# Altium project Sensor.PrjPcb
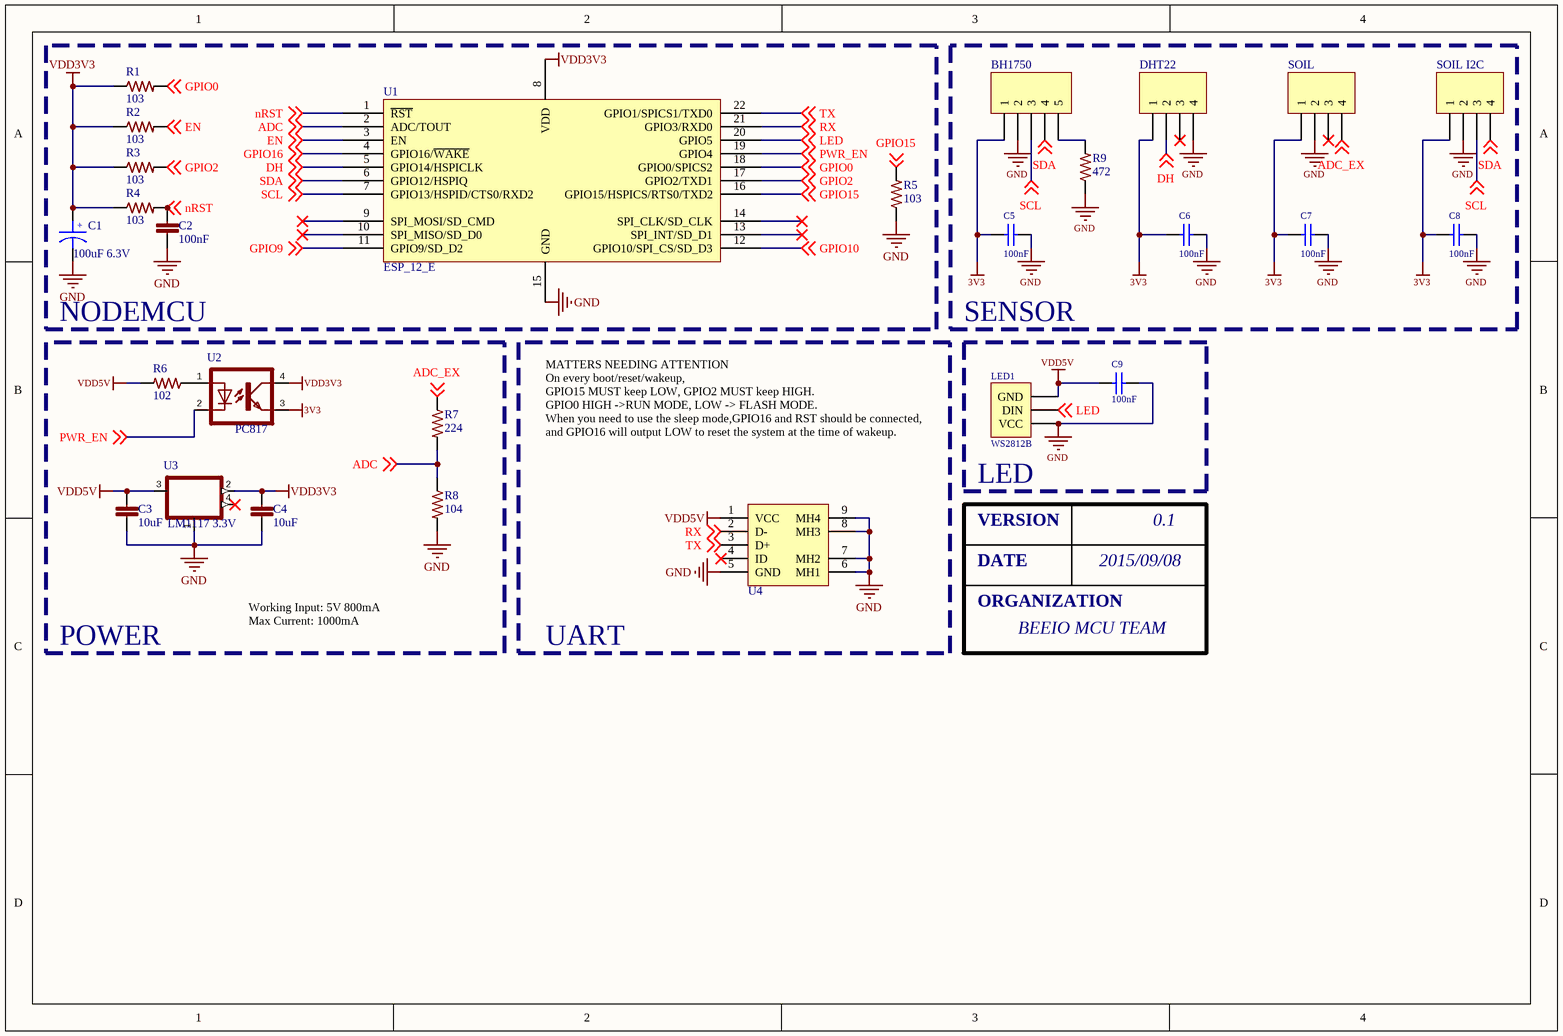
[diagram p0: Sensor.SchDoc]
1 sheet, 27 parts. Net scope: global (net labels, ports and power ports of the same name join across sheets).
Board file: Sensor.PcbDoc

## Sheet Sensor.SchDoc
size A4; Author: Tan Do; CompanyName: Bee Solutions; Organization: PCB; Revision: 0.1; CurrentTime: 14:43; CurrentDate: 2015-07-22; ProjectName: vFarm; Application_BuildNumber: 0.1

### Parts
BH1750  BH1750  [HDR1X5]  (value not drawn)
C1  100uF 6.3V  [SMT_C_Tantalum_B]
C2  100nF  [0603]
C3  10uF  [0603]
C4  10uF  [0603]
C5  100nF  [1608[0603]]
C6  100nF  [1608[0603]]
C7  100nF  [1608[0603]]
C8  100nF  [1608[0603]]
C9  100nF  [1608[0603]]
DHT22  (no value)  [HDR1X4]
LED1  WS2812B  [HDR1X3]
R1  103  [0603]
R2  103  [0603]
R3  103  [0603]
R4  103  [0603]
R5  103  [0603]
R6  102  [0603]
R7  224  [0603]
R8  104  [0603]
R9  472  [0603]
SOIL  (no value)  [HDR1X4]
SOIL_I2C  BH1750  [HDR1X4]  (value not drawn)
U1  ESP_12_E  [ESP_12_E_L]
U2  PC817  [DIL4-SMD]
U3  LM1117 3.3V  [SOT223]
U4  Micro USB 5S DIP  [USB_MICRO_5S_B]  (value not drawn)

### Blocks framed on the sheet
NODEMCU: C1 C2 R1-R5 U1
SENSOR: BH1750 C5-C8 DHT22 R9 SOIL SOIL_I2C
UART: U4

### Nets
3V3: BH1750.1 C5.1 C6.1 C7.1 C8.1 DHT22.1 SOIL.1 SOIL_I2C.1 U2.3(EMIT)
GND: BH1750.2 C1.2 C2.2 C3.1 C4.1 C5.2 C6.2 C7.2 C8.2 C9.2 DHT22.4 LED1.1(VCC) R5.1 R8.2 R9.1 SOIL.2 SOIL_I2C.2 U1.15(GND) U3.1(ADJ) U4.5(GND) U4.6(MH1) U4.7(MH2) U4.8(MH3) U4.9(MH4)
VDD3V3: C1.1 C4.2 R1.1 R2.1 R3.1 R4.1 U1.8(VDD) U2.4(COL) U3.2(OUT)
VDD5V: C3.2 C9.1 LED1.3(GND) R6.2 U3.3(IN) U4.1(VCC)
ADC: R7.2 R8.1 U1.2(ADC/TOUT) ; off-sheet ADC
ADC_EX: R7.1 SOIL.4 ; off-sheet ADC_EX
DH: DHT22.2 U1.5(GPIO14/HSPICLK) ; off-sheet DH
EN: R2.2 U1.3(EN) ; off-sheet EN
GPIO0: R1.2 U1.18(GPIO0/SPICS2) ; off-sheet GPIO0
GPIO2: R3.2 U1.17(GPIO2/TXD1) ; off-sheet GPIO2
GPIO9: U1.11(GPIO9/SD_D2) ; off-sheet GPIO9
GPIO10: U1.12(GPIO10/SPI_CS/SD_D3) ; off-sheet GPIO10
GPIO15: R5.2 U1.16(GPIO15/HSPICS/RTS0/TXD2) ; off-sheet GPIO15
GPIO16: U1.4(GPIO16/~{WAKE}) ; off-sheet GPIO16
LED: LED1.2(DIN) U1.20(GPIO5) ; off-sheet LED
nRST: C2.1 R4.2 U1.1(~{RST}) ; off-sheet nRST
PWR_EN: U1.19(GPIO4) U2.2(C) ; off-sheet PWR_EN
RX: U1.21(GPIO3/RXD0) U4.2(D-) ; off-sheet RX
SCL: BH1750.3 SOIL_I2C.3 U1.7(GPIO13/HSPID/CTS0/RXD2) ; off-sheet SCL
SDA: BH1750.4 SOIL_I2C.4 U1.6(GPIO12/HSPIQ) ; off-sheet SDA
TX: U1.22(GPIO1/SPICS1/TXD0) U4.3(D+) ; off-sheet TX
NetBH1750_5: BH1750.5 R9.2
NetR6_1: R6.1 U2.1(A)

Not connected (* = marked no-connect by the designer): DHT22 3*; SOIL 3*; U1 9(SPI_MOSI/SD_CMD)* 10(SPI_MISO/SD_D0)* 13(SPI_INT/SD_D1)* 14(SPI_CLK/SD_CLK)*; U3 4(OUT)*; U4 4(ID)*

### Notes on the sheet
- MATTERS NEEDING ATTENTION
  On every boot/reset/wakeup,
  GPIO15 MUST keep LOW, GPIO2 MUST keep HIGH.
  GPIO0 HIGH ->RUN MODE, LOW -> FLASH MODE.
  When you need to use the sleep mode,GPIO16 and RST should be connected,
  and GPIO16 will output LOW to reset the system at the time of wakeup.
- (near LED1) LED
- DATE
- VERSION
- 2015/09/08
- 0.1
- POWER
- Working Input: 5V 800mA
  Max Current: 1000mA
- ORGANIZATION
- BEEIO MCU TEAM
- (in symbol SMT_C_Tantalum_B) +

### Library data of the parts
BH1750 = Header 5: Header, 5-Pin; LatestRevisionDate: 17-Jul-2002; LatestRevisionNote: Re-released for DXP Platform.; Publisher: Altium Limited
C1 = SMT_C_Tantalum_B: Capacitor, SM Tantalum; Body 3.5 x 2.8 mm (LxW typ)
C2-C4 = CAP0603
C5-C9 = Cap Semi: Capacitor (Semiconductor SIM Model); Published: 8-Jun-2000; LatestRevisionDate: 29-May-2009; LatestRevisionNote: IPC-7351 Footprint Added.; PackageReference: C1206; Publisher: Altium Limited; PackageDescription: Chip Capacitor; Value: 100nF
DHT22 SOIL SOIL_I2C = Header 4: Header, 4-Pin; LatestRevisionDate: 17-Jul-2002; LatestRevisionNote: Re-released for DXP Platform.; Publisher: Altium Limited
LED1 = Header 3: Header, 3-Pin; LatestRevisionDate: 17-Jul-2002; LatestRevisionNote: Re-released for DXP Platform.; Publisher: Altium Limited
R1-R9 = RESISTOR0603
U1 = ESP_12_E: ESP-12 Wi-Fi Module by AI-Thinker; IC: ESP8266-EX; Vendor: Ai-thinker
U2 = PC817: MPN: PC817X4J000F; OC_FARNELL: 9707727; OC_NEWARK: 97K7059
U3 = V_REG_LM1117SOT223: PROD_ID: VREG-08170
U4 = USB_Micro_5S_B: USB micro female SMT with 4 fixed foot